# EAGLE schematic Parallel CS Prototype multiple sources (EAGLE 7.2.0)

## Sheet 1 of 5: Inputs & FSYNC Switching
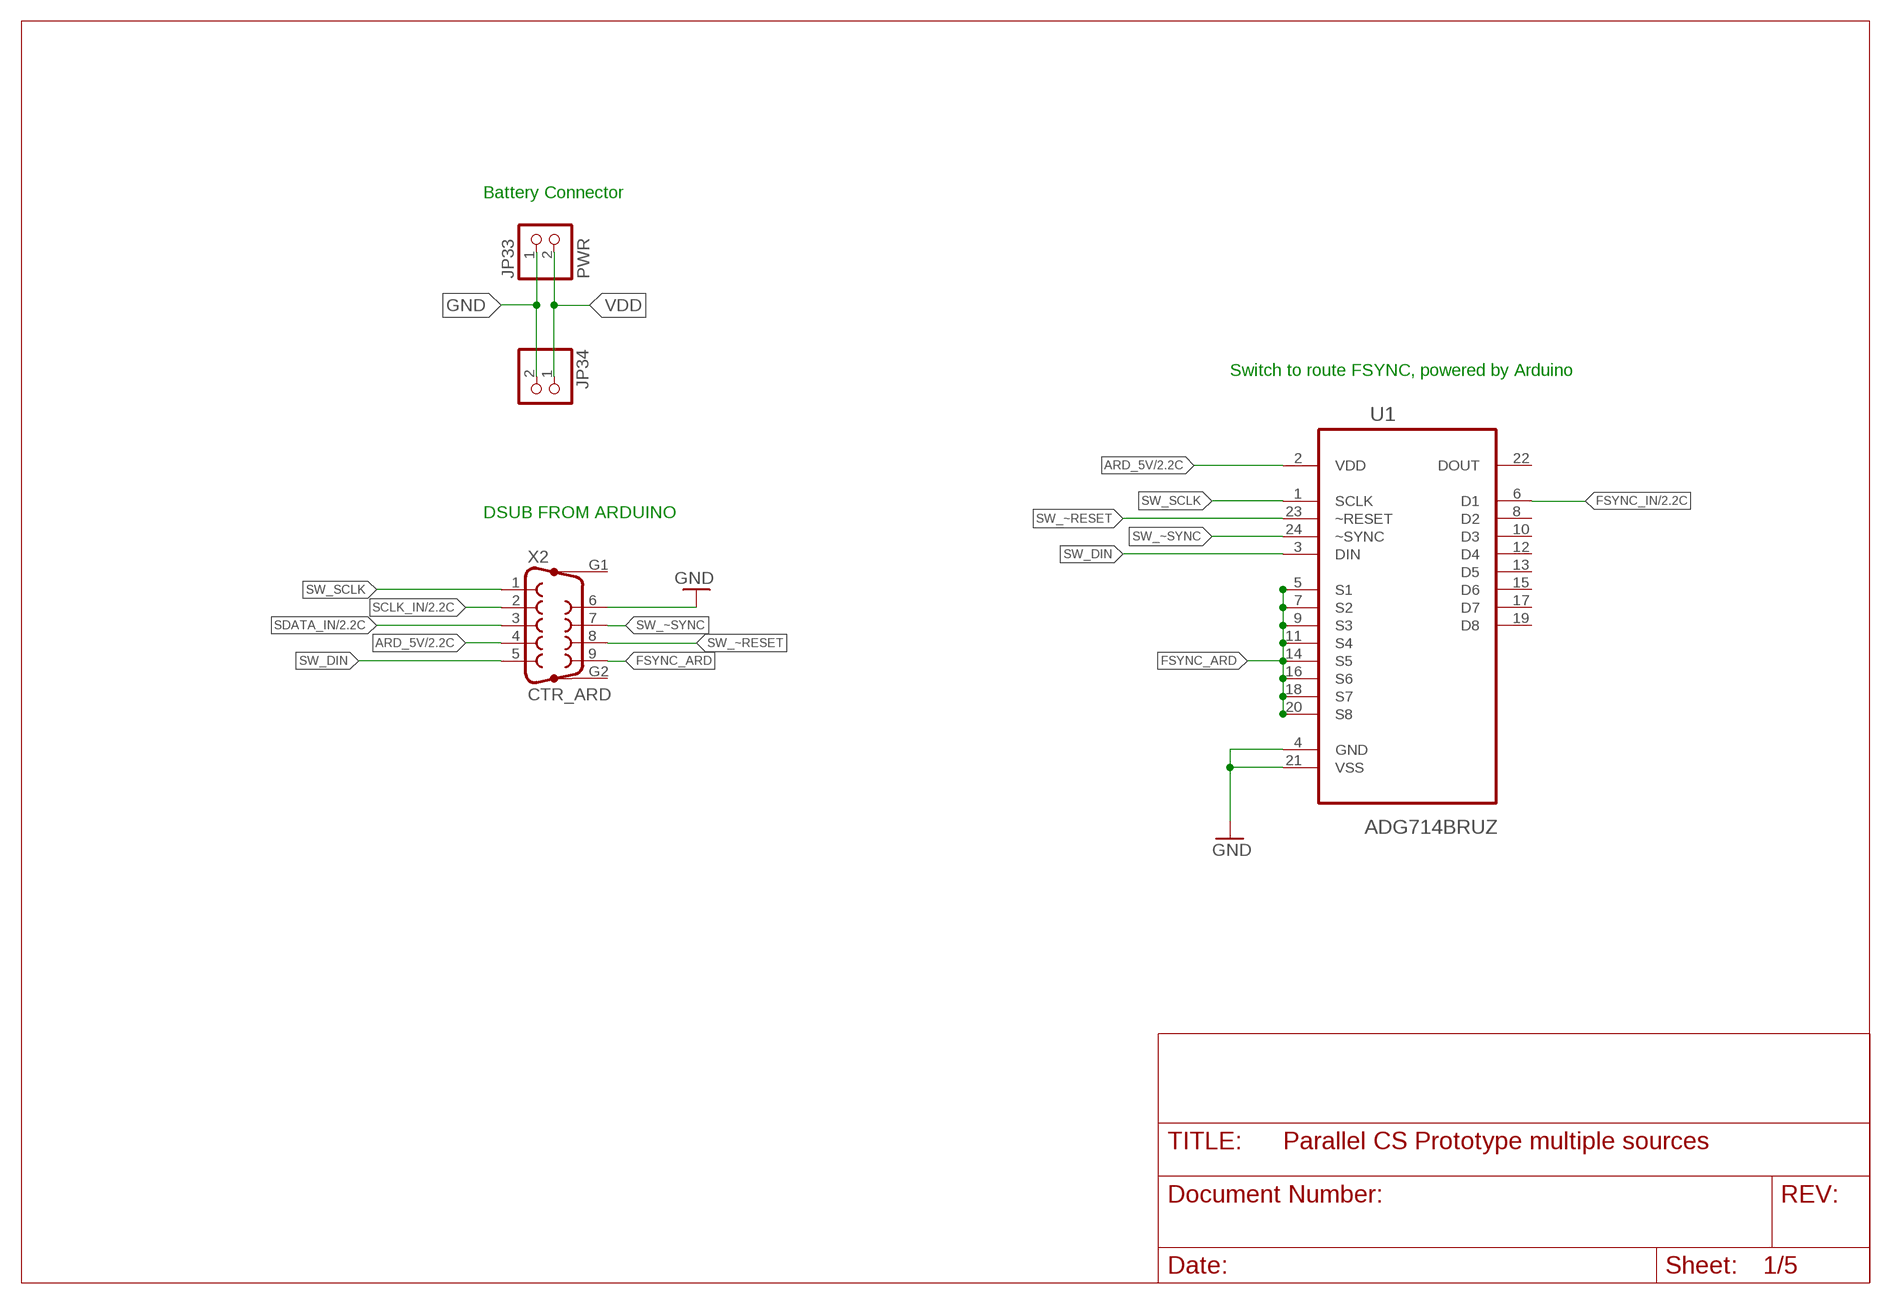
[diagram p0: schematic, sheet 1]

### Parts
JP33  PWR  PINHD-1X2  [1X02]
JP34  PINHD-1X2  [1X02]
U1  ADG714BRUZ  [SOP65P640X120-24N]
X2  CTR_ARD  F09HP  [F09HP]

### Nets
ARD_5V: U1.2(VDD) X2.4 ; also sheet 2,5
FSYNC_ARD: U1.5(S1) U1.7(S2) U1.9(S3) U1.11(S4) U1.14(S5) U1.16(S6) U1.18(S7) U1.20(S8) X2.9
FSYNC_IN: U1.6(D1) ; also sheet 2,5
GND: JP33.1 JP34.2 U1.4(GND) U1.21(VSS) X2.6 ; also sheet 2,5
SCLK_IN: X2.2 ; also sheet 2,5
SDATA_IN: X2.3 ; also sheet 2,5
SW_DIN: U1.3(DIN) X2.5
SW_SCLK: U1.1(SCLK) X2.1
SW_~RESET: U1.23(~RESET) X2.8
SW_~SYNC: U1.24(~SYNC) X2.7
VDD: JP33.2 JP34.1 ; also sheet 2,5
Unconnected: U1.8(D2) U1.10(D3) U1.12(D4) U1.13(D5) U1.15(D6) U1.17(D7) U1.19(D8) U1.22(DOUT) X2.G1 X2.G2

### Notes on the sheet
- Battery Connector
- Switch to route FSYNC, powered by Arduino
- DSUB FROM ARDUINO

## Sheet 2 of 5: Isolated power supply & digital isolator
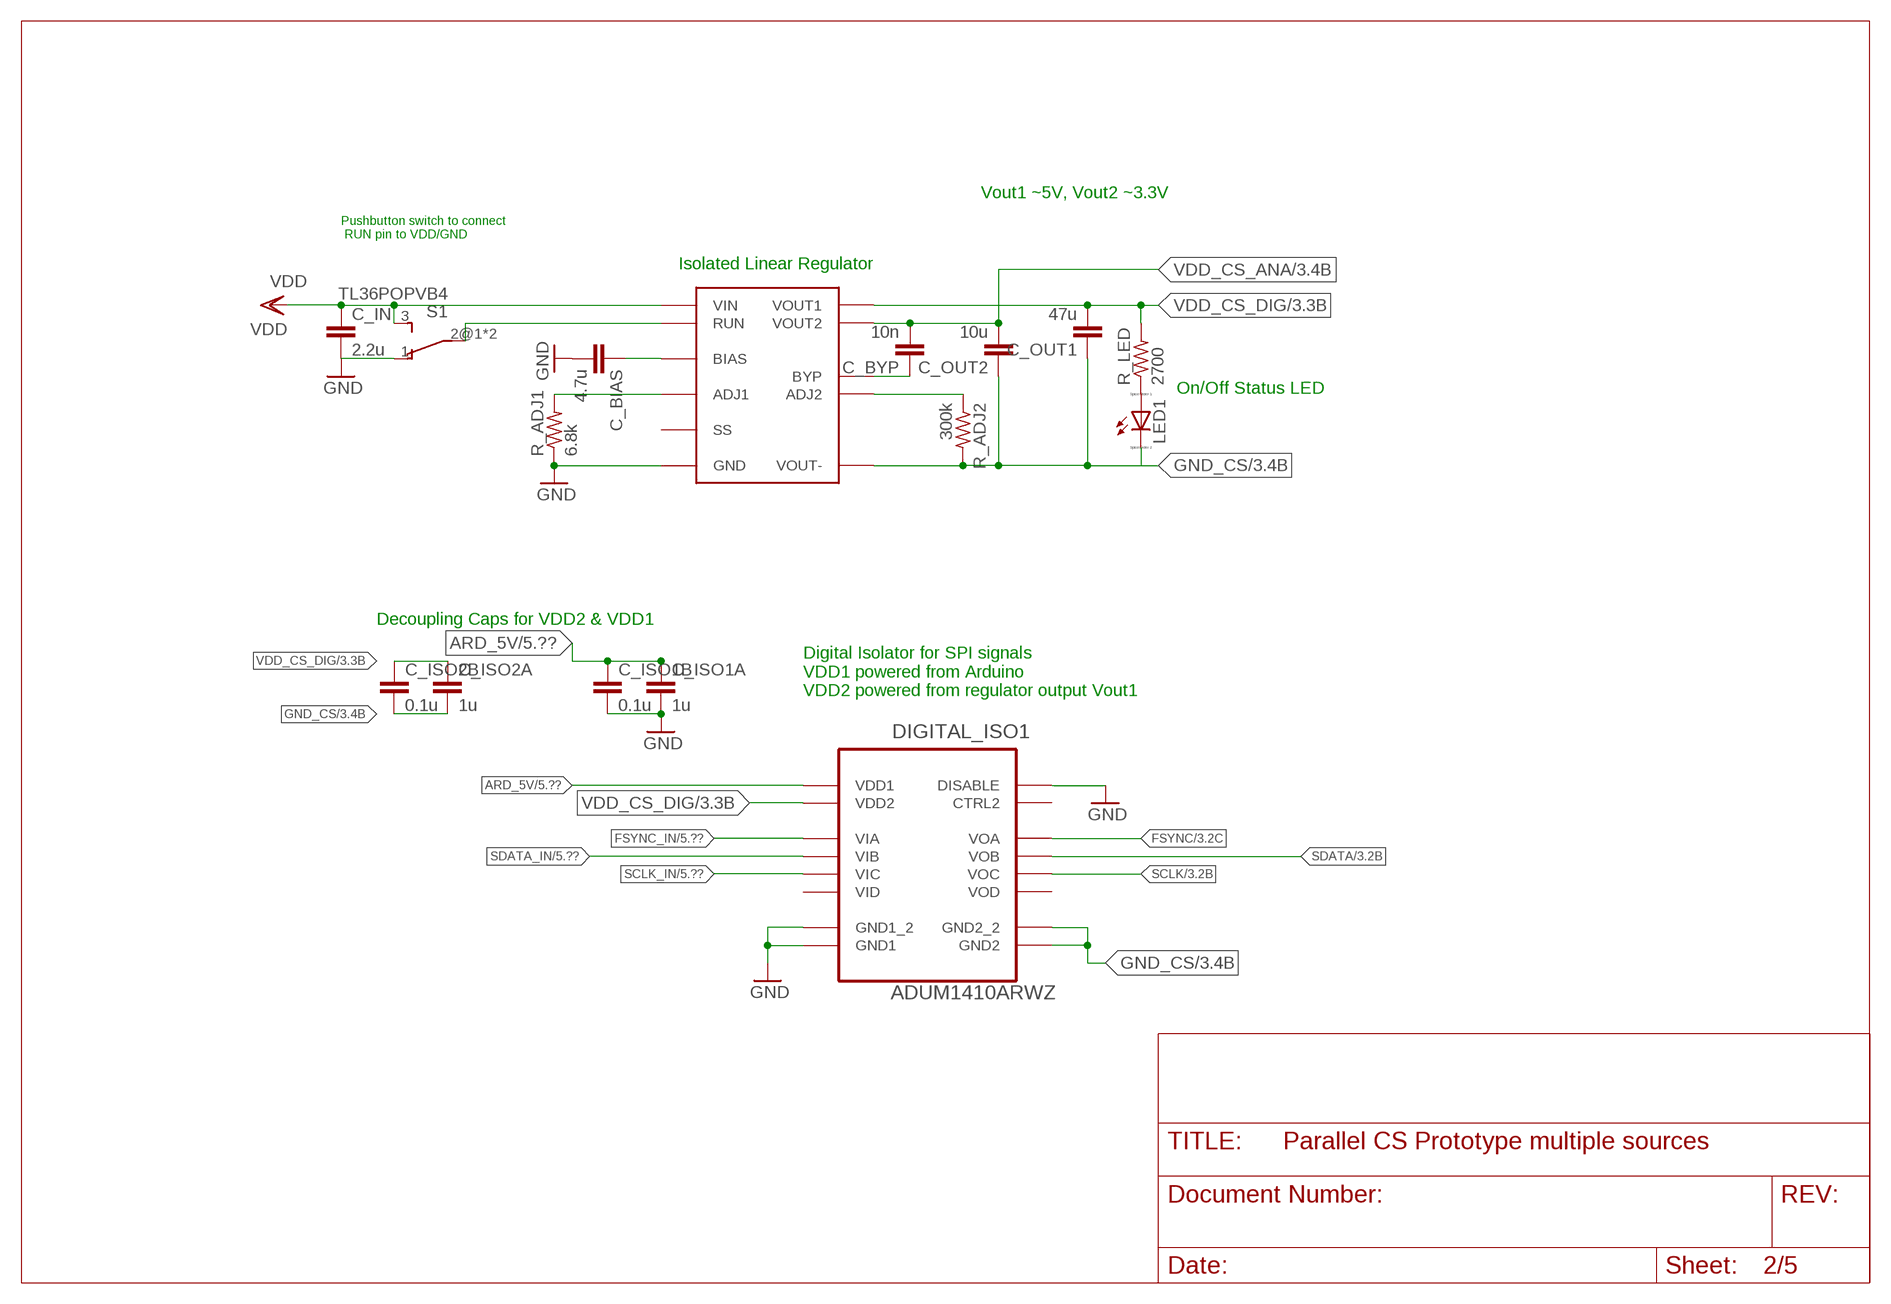
[diagram p1: schematic, sheet 2]

### Parts
C_BIAS  4.7u  C-EUC0805  [C0805]
C_BYP  10n  C-EUC0402  [C0402]
C_IN  2.2u  C-EUC0805  [C0805]
C_ISO1A  1u  C-EUC0402  [C0402]
C_ISO1B  0.1u  C-EUC0402  [C0402]
C_ISO2A  1u  C-EUC0402  [C0402]
C_ISO2B  0.1u  C-EUC0402  [C0402]
C_OUT1  47u  C-EUC0805  [C0805]
C_OUT2  10u  C-EUC0805  [C0805]
DIGITAL_ISO1  ADUM1410ARWZ  [SOIC127P1032X265-16N]
LED1  LED_ESML0603  [LED_SML0603]
R_ADJ1  6.8k  R-US_R0201  [R0201]
R_ADJ2  300k  R-US_R0201  [R0201]
R_LED  2700  R-US_R0402  [R0402]
S1  TL36POPVB4  [PVB4-EE]
U$1  LTM8048  [BGA-49]

### Nets
ARD_5V: C_ISO1A.1 C_ISO1B.1 DIGITAL_ISO1.1(VDD1) ; also sheet 1,5
FSYNC: DIGITAL_ISO1.14(VOA) ; also sheet 3,5
FSYNC_IN: DIGITAL_ISO1.3(VIA) ; also sheet 1,5
GND: C_BIAS.2 C_IN.2 C_ISO1A.2 C_ISO1B.2 DIGITAL_ISO1.2(GND1_2) DIGITAL_ISO1.7(DISABLE) DIGITAL_ISO1.8(GND1) R_ADJ1.1 S1.1(O) U$1.GND@1(GND) U$1.GND@2(GND) U$1.GND@3(GND) U$1.GND@4(GND) U$1.GND@5(GND) U$1.GND@6(GND) U$1.GND@7(GND) U$1.GND@8(GND) U$1.GND@9(GND) U$1.GND@10(GND) U$1.GND@11(GND) U$1.GND@12(GND) U$1.GND@13(GND) U$1.GND@14(GND) U$1.GND@15(GND) U$1.GND@16(GND) ; also sheet 1,5
GND_CS: C_ISO2A.2 C_ISO2B.2 C_OUT1.1 C_OUT2.1 DIGITAL_ISO1.9(GND2_2) DIGITAL_ISO1.15(GND2) LED1.C R_ADJ2.2 U$1.VOUT-@1(VOUT-) U$1.VOUT-@2(VOUT-) U$1.VOUT-@3(VOUT-) U$1.VOUT-@4(VOUT-) U$1.VOUT-@5(VOUT-) U$1.VOUT-@6(VOUT-) U$1.VOUT-@7(VOUT-) U$1.VOUT-@8(VOUT-) U$1.VOUT-@9(VOUT-) ; also sheet 3,5
N$2: C_BYP.1 U$1.BYP
N$3: S1.2@1(P) S1.2@2(P) U$1.RUN
N$6: LED1.A R_LED.1
N$10: C_BIAS.1 U$1.BIAS
N$11: R_ADJ1.2 U$1.ADJ1
N$13: R_ADJ2.1 U$1.ADJ2
SCLK: DIGITAL_ISO1.12(VOC) ; also sheet 3,5
SCLK_IN: DIGITAL_ISO1.5(VIC) ; also sheet 1,5
SDATA: DIGITAL_ISO1.13(VOB) ; also sheet 3,5
SDATA_IN: DIGITAL_ISO1.4(VIB) ; also sheet 1,5
VDD: C_IN.1 S1.3(S) U$1.VIN@1(VIN) U$1.VIN@2(VIN) U$1.VIN@3(VIN) U$1.VIN@4(VIN) ; also sheet 1,5
VDD_CS_ANA: C_BYP.2 C_OUT2.2 U$1.VOUT2@1(VOUT2) U$1.VOUT2@2(VOUT2) U$1.VOUT2@3(VOUT2) U$1.VOUT2@4(VOUT2) ; also sheet 3,5
VDD_CS_DIG: C_ISO2A.1 C_ISO2B.1 C_OUT1.2 DIGITAL_ISO1.16(VDD2) R_LED.2 U$1.VOUT1@1(VOUT1) U$1.VOUT1@2(VOUT1) U$1.VOUT1@3(VOUT1) U$1.VOUT1@4(VOUT1) U$1.VOUT1@5(VOUT1) U$1.VOUT1@6(VOUT1) ; also sheet 3,5
Unconnected: DIGITAL_ISO1.6(VID) DIGITAL_ISO1.10(CTRL2) DIGITAL_ISO1.11(VOD) U$1.SS

### Notes on the sheet
- Vout1 ~5V, Vout2 ~3.3V
- Pushbutton switch to connect
   RUN pin to VDD/GND
- Isolated Linear Regulator
- On/Off Status LED
- Decoupling Caps for VDD2 & VDD1
- Digital Isolator for SPI signals
  VDD1 powered from Arduino
  VDD2 powered from regulator output Vout1

## Sheet 3 of 5: Current Source Block
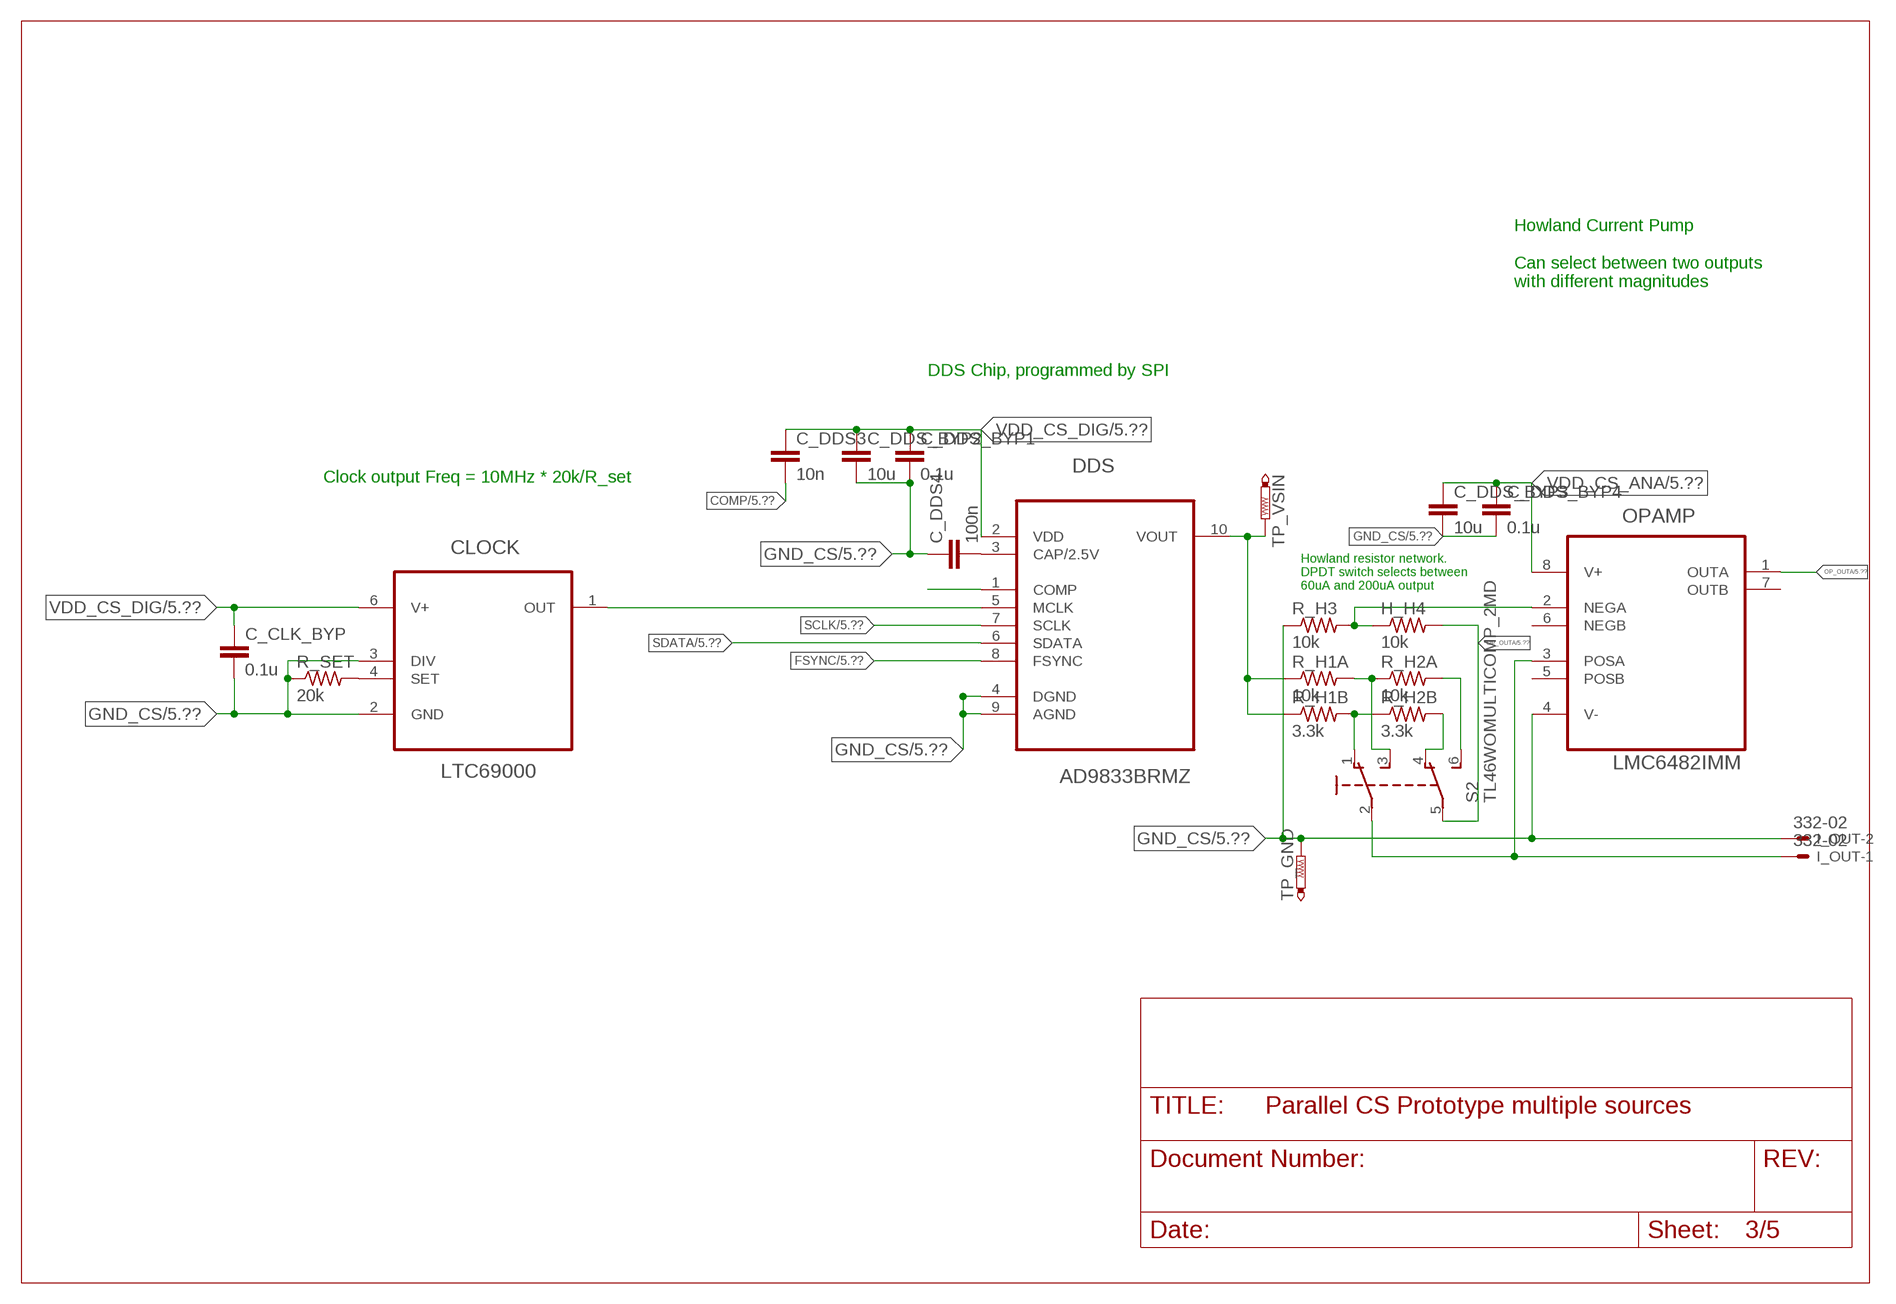
[diagram p2: schematic, sheet 3]

### Parts
C_CLK_BYP  0.1u  C-EUC0402  [C0402]
C_DDS3  10n  C-EUC0402  [C0402]
C_DDS4  100n  C-EUC0402  [C0402]
C_DDS_BYP1  0.1u  C-EUC0402  [C0402]
C_DDS_BYP2  10u  C-EUC0402  [C0402]
C_DDS_BYP3  10u  C-EUC0402  [C0402]
C_DDS_BYP4  0.1u  C-EUC0402  [C0402]
CLOCK  LTC69000  [SOT95P280X100-6N]
DDS  AD9833BRMZ  [SOP50P490X110-10N]
H_H4  10k  R-US_R0603  [R0603]
I_OUT  332-02  [332-02]
OPAMP  LMC6482IMM  [SOP65P490X109-8N]
R_H1A  10k  R-US_R0603  [R0603]
R_H1B  3.3k  R-US_R0603  [R0603]
R_H2A  10k  R-US_R0603  [R0603]
R_H2B  3.3k  R-US_R0603  [R0603]
R_H3  10k  R-US_R0603  [R0603]
R_SET  20k  R-US_R0603  [R0603]
S2  TL46WOMULTICOMP_2MD  [TL4XPO]
TP_GND  PTR1PAD1-13  [P1-13]
TP_VSIN  PTR1PAD1-13  [P1-13]

### Nets
CLK_OUT: CLOCK.1(OUT) DDS.5(MCLK)
COMP: C_DDS3.2 DDS.1(COMP) ; also sheet 5
FSYNC: DDS.8(FSYNC) ; also sheet 2,5
GND_CS: C_CLK_BYP.2 C_DDS4.1 C_DDS_BYP1.2 C_DDS_BYP2.2 C_DDS_BYP3.2 C_DDS_BYP4.2 CLOCK.2(GND) CLOCK.3(DIV) DDS.4(DGND) DDS.9(AGND) I_OUT.2 OPAMP.4(V-) R_H3.1 R_SET.1 TP_GND.TP ; also sheet 2,5
IOUT: I_OUT.1 OPAMP.3(POSA) S2.2(P)
N$1: C_DDS4.2 DDS.3(CAP/2.5V)
N$7: R_H2A.2 S2.6(S1)
N$8: CLOCK.4(SET) R_SET.2
N$9: R_H2B.2 S2.4(O1)
N$12: R_H1B.2 R_H2B.1 S2.1(O)
N$15: R_H1A.2 R_H2A.1 S2.3(S)
NEGA: H_H4.1 OPAMP.2(NEGA) R_H3.2
OP_OUTA: H_H4.2 OPAMP.1(OUTA) S2.5(P1) ; also sheet 5
SCLK: DDS.7(SCLK) ; also sheet 2,5
SDATA: DDS.6(SDATA) ; also sheet 2,5
V_SINE: DDS.10(VOUT) R_H1A.1 R_H1B.1 TP_VSIN.TP
VDD_CS_ANA: C_DDS_BYP3.1 C_DDS_BYP4.1 OPAMP.8(V+) ; also sheet 2,5
VDD_CS_DIG: C_CLK_BYP.1 C_DDS3.1 C_DDS_BYP1.1 C_DDS_BYP2.1 CLOCK.6(V+) DDS.2(VDD) ; also sheet 2,5
Unconnected: OPAMP.5(POSB) OPAMP.6(NEGB) OPAMP.7(OUTB)

### Notes on the sheet
- Howland Current Pump
  
  Can select between two outputs
  with different magnitudes
- DDS Chip, programmed by SPI
- Clock output Freq = 10MHz * 20k/R_set
- Howland resistor network.
  DPDT switch selects between
  60uA and 200uA output

## Sheet 4 of 5: Outputs
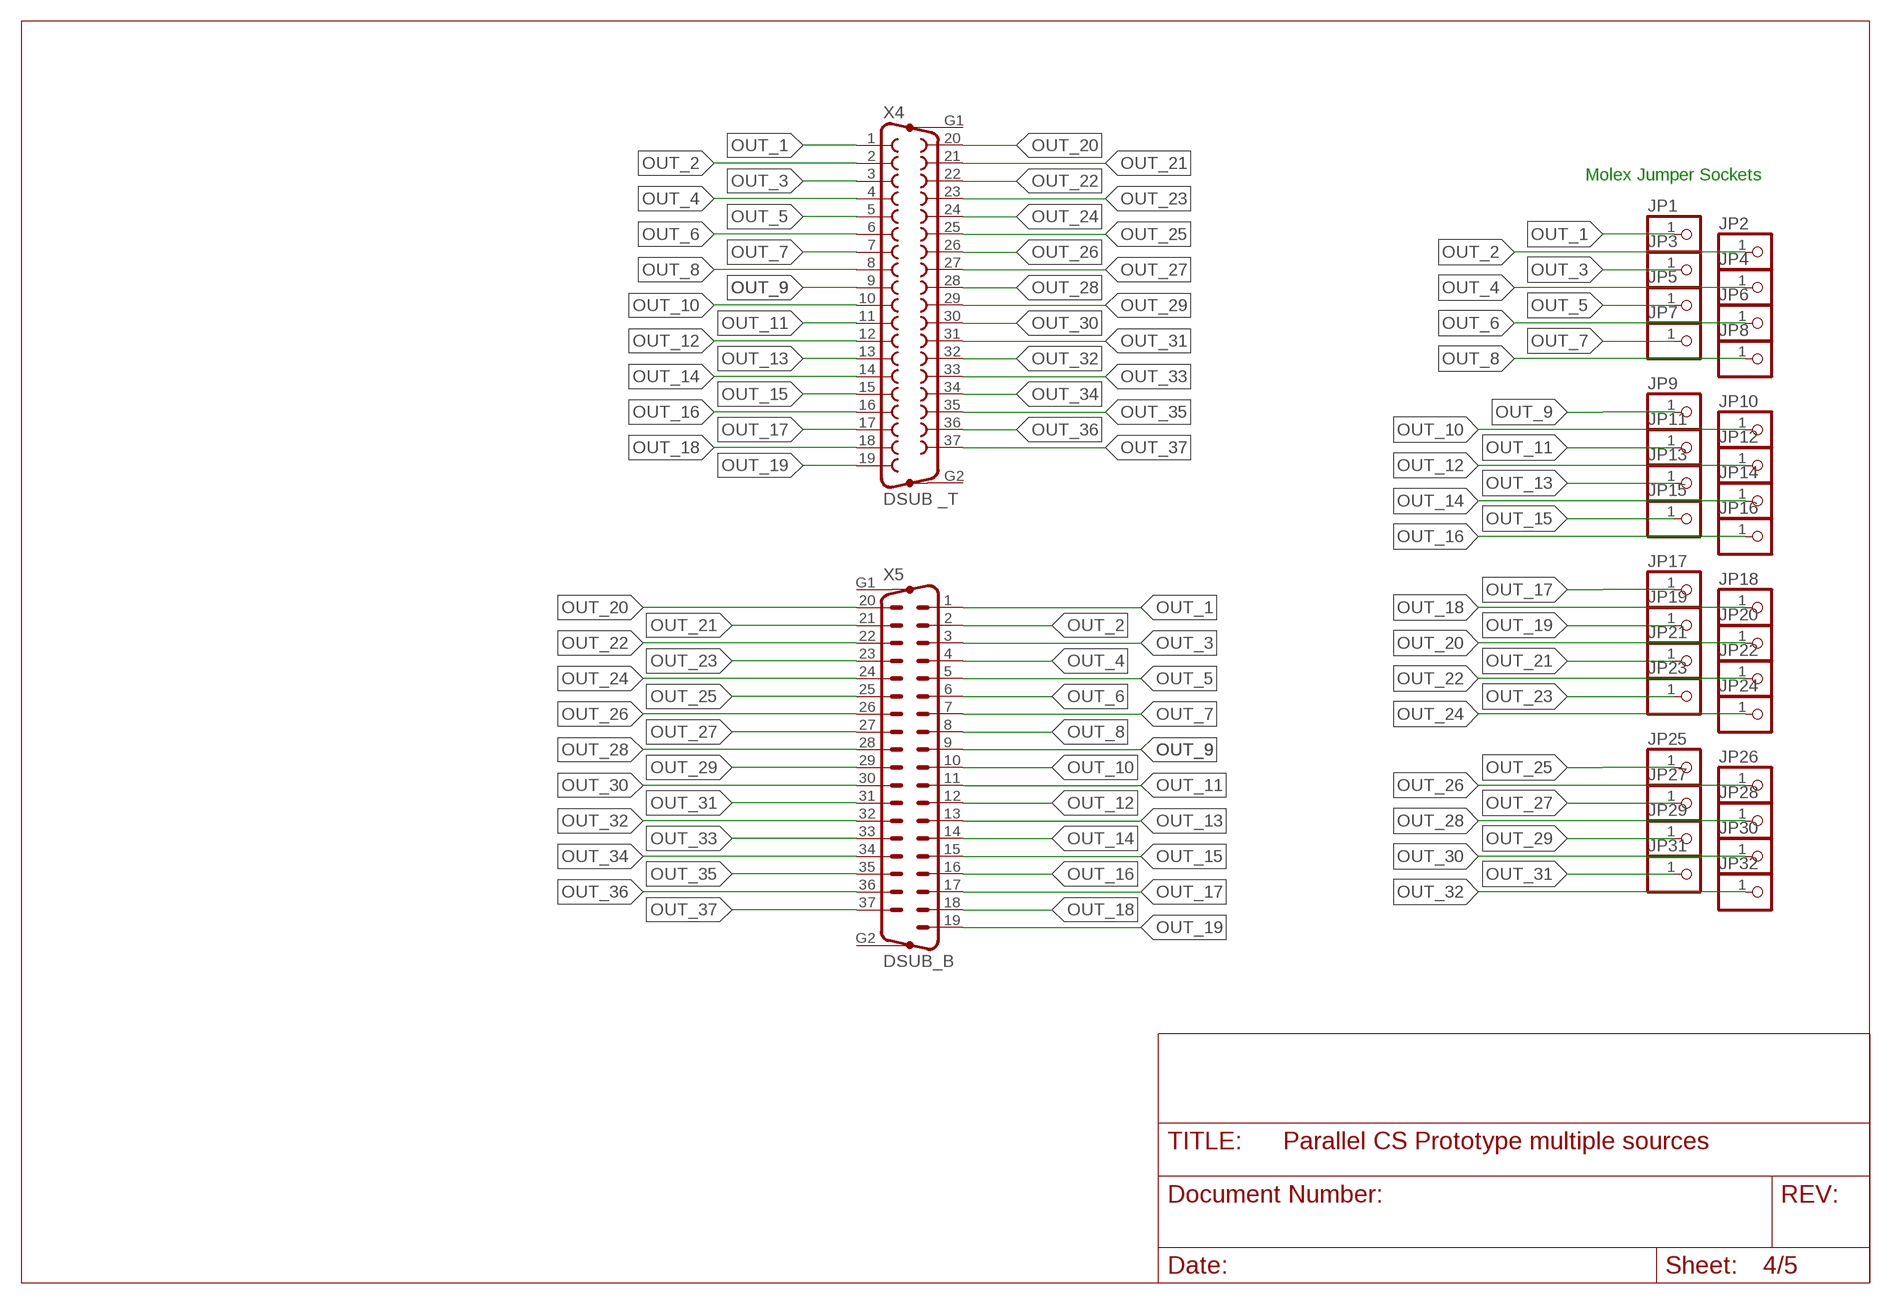
[diagram p3: schematic, sheet 4]

### Parts
JP1  PINHD-1X1  [1X01]
JP2  PINHD-1X1  [1X01]
JP3  PINHD-1X1  [1X01]
JP4  PINHD-1X1  [1X01]
JP5  PINHD-1X1  [1X01]
JP6  PINHD-1X1  [1X01]
JP7  PINHD-1X1  [1X01]
JP8  PINHD-1X1  [1X01]
JP9  PINHD-1X1  [1X01]
JP10  PINHD-1X1  [1X01]
JP11  PINHD-1X1  [1X01]
JP12  PINHD-1X1  [1X01]
JP13  PINHD-1X1  [1X01]
JP14  PINHD-1X1  [1X01]
JP15  PINHD-1X1  [1X01]
JP16  PINHD-1X1  [1X01]
JP17  PINHD-1X1  [1X01]
JP18  PINHD-1X1  [1X01]
JP19  PINHD-1X1  [1X01]
JP20  PINHD-1X1  [1X01]
JP21  PINHD-1X1  [1X01]
JP22  PINHD-1X1  [1X01]
JP23  PINHD-1X1  [1X01]
JP24  PINHD-1X1  [1X01]
JP25  PINHD-1X1  [1X01]
JP26  PINHD-1X1  [1X01]
JP27  PINHD-1X1  [1X01]
JP28  PINHD-1X1  [1X01]
JP29  PINHD-1X1  [1X01]
JP30  PINHD-1X1  [1X01]
JP31  PINHD-1X1  [1X01]
JP32  PINHD-1X1  [1X01]
X4  DSUB _T  F37HP  [F37HP]
X5  DSUB_B  M37HP  [M37HP]

### Nets
OUT_1: JP1.1 X4.1 X5.1
OUT_2: JP2.1 X4.2 X5.2
OUT_3: JP3.1 X4.3 X5.3
OUT_4: JP4.1 X4.4 X5.4
OUT_5: JP5.1 X4.5 X5.5
OUT_6: JP6.1 X4.6 X5.6
OUT_7: JP7.1 X4.7 X5.7
OUT_8: JP8.1 X4.8 X5.8
OUT_9: JP9.1 X4.9 X5.9
OUT_10: JP10.1 X4.10 X5.10
OUT_11: JP11.1 X4.11 X5.11
OUT_12: JP12.1 X4.12 X5.12
OUT_13: JP13.1 X4.13 X5.13
OUT_14: JP14.1 X4.14 X5.14
OUT_15: JP15.1 X4.15 X5.15
OUT_16: JP16.1 X4.16 X5.16
OUT_17: JP17.1 X4.17 X5.17
OUT_18: JP18.1 X4.18 X5.18
OUT_19: JP19.1 X4.19 X5.19
OUT_20: JP20.1 X4.20 X5.20
OUT_21: JP21.1 X4.21 X5.21
OUT_22: JP22.1 X4.22 X5.22
OUT_23: JP23.1 X4.23 X5.23
OUT_24: JP24.1 X4.24 X5.24
OUT_25: JP25.1 X4.25 X5.25
OUT_26: JP26.1 X4.26 X5.26
OUT_27: JP27.1 X4.27 X5.27
OUT_28: JP28.1 X4.28 X5.28
OUT_29: JP29.1 X4.29 X5.29
OUT_30: JP30.1 X4.30 X5.30
OUT_31: JP31.1 X4.31 X5.31
OUT_32: JP32.1 X4.32 X5.32
OUT_33: X4.33 X5.33
OUT_34: X4.34 X5.34
OUT_35: X4.35 X5.35
OUT_36: X4.36 X5.36
OUT_37: X4.37 X5.37
Unconnected: X4.G1 X4.G2 X5.G1 X5.G2

### Notes on the sheet
- Molex Jumper Sockets

## Sheet 5 of 5
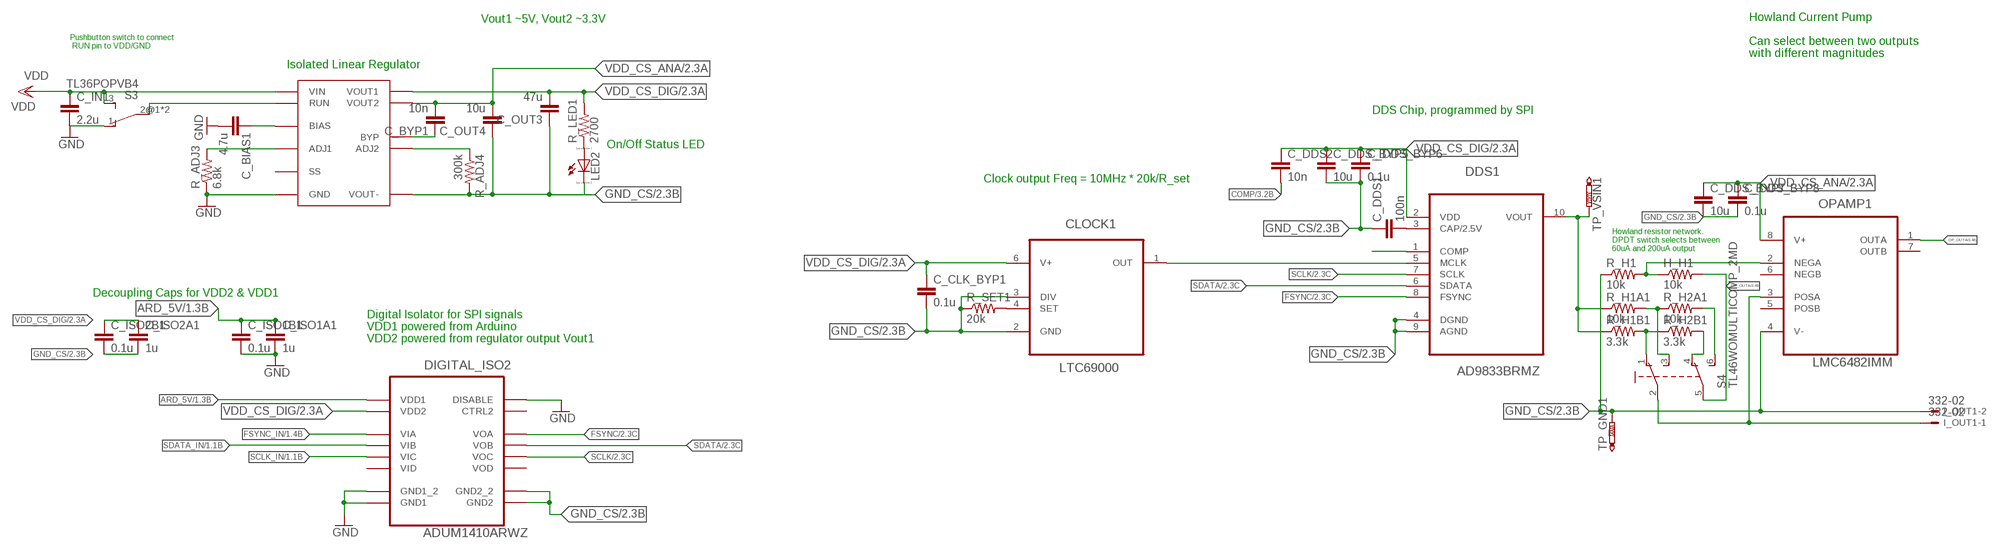
[diagram p4: schematic, sheet 5]

### Parts
C_BIAS1  4.7u  C-EUC0805  [C0805]
C_BYP1  10n  C-EUC0402  [C0402]
C_CLK_BYP1  0.1u  C-EUC0402  [C0402]
C_DDS1  100n  C-EUC0402  [C0402]
C_DDS2  10n  C-EUC0402  [C0402]
C_DDS_BYP5  10u  C-EUC0402  [C0402]
C_DDS_BYP6  0.1u  C-EUC0402  [C0402]
C_DDS_BYP7  10u  C-EUC0402  [C0402]
C_DDS_BYP8  0.1u  C-EUC0402  [C0402]
C_IN1  2.2u  C-EUC0805  [C0805]
C_ISO1A1  1u  C-EUC0402  [C0402]
C_ISO1B1  0.1u  C-EUC0402  [C0402]
C_ISO2A1  1u  C-EUC0402  [C0402]
C_ISO2B1  0.1u  C-EUC0402  [C0402]
C_OUT3  47u  C-EUC0805  [C0805]
C_OUT4  10u  C-EUC0805  [C0805]
CLOCK1  LTC69000  [SOT95P280X100-6N]
DDS1  AD9833BRMZ  [SOP50P490X110-10N]
DIGITAL_ISO2  ADUM1410ARWZ  [SOIC127P1032X265-16N]
H_H1  10k  R-US_R0603  [R0603]
I_OUT1  332-02  [332-02]
LED2  LED_ESML0603  [LED_SML0603]
OPAMP1  LMC6482IMM  [SOP65P490X109-8N]
R_ADJ3  6.8k  R-US_R0201  [R0201]
R_ADJ4  300k  R-US_R0201  [R0201]
R_H1  10k  R-US_R0603  [R0603]
R_H1A1  10k  R-US_R0603  [R0603]
R_H1B1  3.3k  R-US_R0603  [R0603]
R_H2A1  10k  R-US_R0603  [R0603]
R_H2B1  3.3k  R-US_R0603  [R0603]
R_LED1  2700  R-US_R0402  [R0402]
R_SET1  20k  R-US_R0603  [R0603]
S3  TL36POPVB4  [PVB4-EE]
S4  TL46WOMULTICOMP_2MD  [TL4XPO]
TP_GND1  PTR1PAD1-13  [P1-13]
TP_VSIN1  PTR1PAD1-13  [P1-13]
U$2  LTM8048  [BGA-49]

### Nets
ARD_5V: C_ISO1A1.1 C_ISO1B1.1 DIGITAL_ISO2.1(VDD1) ; also sheet 1,2
CLK_OUT1: CLOCK1.1(OUT) DDS1.5(MCLK)
COMP: C_DDS2.2 DDS1.1(COMP) ; also sheet 3
FSYNC: DDS1.8(FSYNC) DIGITAL_ISO2.14(VOA) ; also sheet 2,3
FSYNC_IN: DIGITAL_ISO2.3(VIA) ; also sheet 1,2
GND: C_BIAS1.2 C_IN1.2 C_ISO1A1.2 C_ISO1B1.2 DIGITAL_ISO2.2(GND1_2) DIGITAL_ISO2.7(DISABLE) DIGITAL_ISO2.8(GND1) R_ADJ3.1 S3.1(O) U$2.GND@1(GND) U$2.GND@2(GND) U$2.GND@3(GND) U$2.GND@4(GND) U$2.GND@5(GND) U$2.GND@6(GND) U$2.GND@7(GND) U$2.GND@8(GND) U$2.GND@9(GND) U$2.GND@10(GND) U$2.GND@11(GND) U$2.GND@12(GND) U$2.GND@13(GND) U$2.GND@14(GND) U$2.GND@15(GND) U$2.GND@16(GND) ; also sheet 1,2
GND_CS: C_CLK_BYP1.2 C_DDS1.1 C_DDS_BYP5.2 C_DDS_BYP6.2 C_DDS_BYP7.2 C_DDS_BYP8.2 C_ISO2A1.2 C_ISO2B1.2 C_OUT3.1 C_OUT4.1 CLOCK1.2(GND) CLOCK1.3(DIV) DDS1.4(DGND) DDS1.9(AGND) DIGITAL_ISO2.9(GND2_2) DIGITAL_ISO2.15(GND2) I_OUT1.2 LED2.C OPAMP1.4(V-) R_ADJ4.2 R_H1.1 R_SET1.1 TP_GND1.TP U$2.VOUT-@1(VOUT-) U$2.VOUT-@2(VOUT-) U$2.VOUT-@3(VOUT-) U$2.VOUT-@4(VOUT-) U$2.VOUT-@5(VOUT-) U$2.VOUT-@6(VOUT-) U$2.VOUT-@7(VOUT-) U$2.VOUT-@8(VOUT-) U$2.VOUT-@9(VOUT-) ; also sheet 2,3
IOUT1: I_OUT1.1 OPAMP1.3(POSA) S4.2(P)
N$4: C_BIAS1.1 U$2.BIAS
N$5: R_ADJ3.2 U$2.ADJ1
N$14: R_ADJ4.1 U$2.ADJ2
N$16: C_BYP1.1 U$2.BYP
N$17: S3.2@1(P) S3.2@2(P) U$2.RUN
N$18: LED2.A R_LED1.1
N$19: C_DDS1.2 DDS1.3(CAP/2.5V)
N$20: CLOCK1.4(SET) R_SET1.2
N$21: R_H1B1.2 R_H2B1.1 S4.1(O)
N$22: R_H2A1.2 S4.6(S1)
N$23: R_H1A1.2 R_H2A1.1 S4.3(S)
N$24: R_H2B1.2 S4.4(O1)
NEGA1: H_H1.1 OPAMP1.2(NEGA) R_H1.2
OP_OUTA: H_H1.2 OPAMP1.1(OUTA) S4.5(P1) ; also sheet 3
SCLK: DDS1.7(SCLK) DIGITAL_ISO2.12(VOC) ; also sheet 2,3
SCLK_IN: DIGITAL_ISO2.5(VIC) ; also sheet 1,2
SDATA: DDS1.6(SDATA) DIGITAL_ISO2.13(VOB) ; also sheet 2,3
SDATA_IN: DIGITAL_ISO2.4(VIB) ; also sheet 1,2
V_SINE1: DDS1.10(VOUT) R_H1A1.1 R_H1B1.1 TP_VSIN1.TP
VDD: C_IN1.1 S3.3(S) U$2.VIN@1(VIN) U$2.VIN@2(VIN) U$2.VIN@3(VIN) U$2.VIN@4(VIN) ; also sheet 1,2
VDD_CS_ANA: C_BYP1.2 C_DDS_BYP7.1 C_DDS_BYP8.1 C_OUT4.2 OPAMP1.8(V+) U$2.VOUT2@1(VOUT2) U$2.VOUT2@2(VOUT2) U$2.VOUT2@3(VOUT2) U$2.VOUT2@4(VOUT2) ; also sheet 2,3
VDD_CS_DIG: C_CLK_BYP1.1 C_DDS2.1 C_DDS_BYP5.1 C_DDS_BYP6.1 C_ISO2A1.1 C_ISO2B1.1 C_OUT3.2 CLOCK1.6(V+) DDS1.2(VDD) DIGITAL_ISO2.16(VDD2) R_LED1.2 U$2.VOUT1@1(VOUT1) U$2.VOUT1@2(VOUT1) U$2.VOUT1@3(VOUT1) U$2.VOUT1@4(VOUT1) U$2.VOUT1@5(VOUT1) U$2.VOUT1@6(VOUT1) ; also sheet 2,3
Unconnected: DIGITAL_ISO2.6(VID) DIGITAL_ISO2.10(CTRL2) DIGITAL_ISO2.11(VOD) OPAMP1.5(POSB) OPAMP1.6(NEGB) OPAMP1.7(OUTB) U$2.SS

### Notes on the sheet
- Vout1 ~5V, Vout2 ~3.3V
- Pushbutton switch to connect
   RUN pin to VDD/GND
- Howland Current Pump
  
  Can select between two outputs
  with different magnitudes
- Isolated Linear Regulator
- DDS Chip, programmed by SPI
- On/Off Status LED
- Clock output Freq = 10MHz * 20k/R_set
- Howland resistor network.
  DPDT switch selects between
  60uA and 200uA output
- Decoupling Caps for VDD2 & VDD1
- Digital Isolator for SPI signals
  VDD1 powered from Arduino
  VDD2 powered from regulator output Vout1

## Library data of the parts
C_BIAS C_BIAS1 C_BYP C_BYP1 C_CLK_BYP C_CLK_BYP1 C_DDS1-C_DDS4 C_DDS_BYP1-C_DDS_BYP8 C_IN C_IN1 C_ISO1A C_ISO1A1 C_ISO1B C_ISO1B1 C_ISO2A C_ISO2A1 C_ISO2B C_ISO2B1 C_OUT1-C_OUT4 = resistor:C-EU: CAPACITOR, European symbol
CLOCK CLOCK1 = LTC6900:LTC69000: Low Power, 1kHz to 20MHz Resistor Set SOT-23 Oscillator; MPN: LTC6906IS6#PBF; OC_FARNELL: 1432109; OC_NEWARK: 10R6975; PACKAGE: TSOT-23-6; SUPPLIER: Linear Technology
DDS DDS1 = ad9833:AD9833BRMZ: Low Power 12.65 mW, 2.3 V to 5.5 V,Low Power 12.65 mW, 2.3 V to 5.5 V,Low Power 12.65 mW, 2.3 V to 5.5 V,Programmable Waveform Generator; MPN: AD9833BRMZ; OC_FARNELL: 1581966; OC_NEWARK: 19M1014; PACKAGE: MSOP-10; SUPPLIER: Analog Devices
DIGITAL_ISO1 DIGITAL_ISO2 = SwitchBoard:ADUM1410ARWZ: ISOLATOR, DGTL, 4CHAN; MPN: ADUM1410ARWZ; OC_FARNELL: 2067770; OC_NEWARK: 73T8174; PACKAGE: 16-Lead SOIC_W; SUPPLIER: Analog Devices
H_H1 H_H4 R_ADJ1-R_ADJ4 R_H1 R_H1A R_H1A1 R_H1B R_H1B1 R_H2A R_H2A1 R_H2B R_H2B1 R_H3 R_LED R_LED1 R_SET R_SET1 = resistor:R-US_: RESISTOR, American symbol
I_OUT I_OUT1 = con-garry:332-02: 2 Pin - 2mm Dual Row Source: www.mpe-connector.de / garry_shortform_2012.pdf
JP1-JP32 = SwitchBoard:PINHD-1X1: PIN HEADER
JP33 = pinhead:PINHD-1X2: PIN HEADER
JP34 = SwitchBoard:PINHD-1X2: PIN HEADER
LED1 LED2 = eagle-ltspice:LED_E: LED Source: http://www.osram.convergy.de Source: www.luxeon.com Source: www.kingbright.com; SPICEMODEL: NONE; SPICEPREFIX: D; SPICETYPE: diode
OPAMP OPAMP1 = LMC6482:LMC6482IMM: OpAmpIC; MPN: LMC6482IMM; OC_FARNELL: 1468890; OC_NEWARK: 83F3826; PACKAGE: MSOP-8; SUPPLIER: NationalSemiconductor
S1 S3 = switch:TL36PO: TINY SWITCH ON - ON Source: http://www2.produktinfo.conrad.com/datenblaetter/700000-724999/705152-da-01-de-Subminiaturschalter_TL_36YO.pdf
S2 S4 = switch:TL46WO: TINY SWITCH ON - ON Source: http://www2.produktinfo.conrad.com/datenblaetter/700000-724999/705152-da-01-de-Subminiaturschalter_TL_36WO.pdf
TP_GND TP_GND1 TP_VSIN TP_VSIN1 = testpad:PTR1: TEST PIN
U1 = SwitchBoard:ADG714BRUZ: CMOS, Low Voltage Serially Controlled, Octal SPST Switches; MPN: ADG714BRUZ; OC_FARNELL: 9604367; OC_NEWARK: 59K1531; PACKAGE: TSSOP-24; SUPPLIER: Analog Devices
U$1 U$2 = LTM8048:LTM8048
X2 = con-subd:F09HP: SUB-D; OC_FARNELL: unknown; OC_NEWARK: unknown
X4 = con-subd:F37HP: SUB-D; OC_FARNELL: unknown; OC_NEWARK: unknown
X5 = con-subd:M37HP: SUB-D; OC_FARNELL: unknown; OC_NEWARK: unknown